# EAGLE design Impedance (EAGLE 9.6.2)
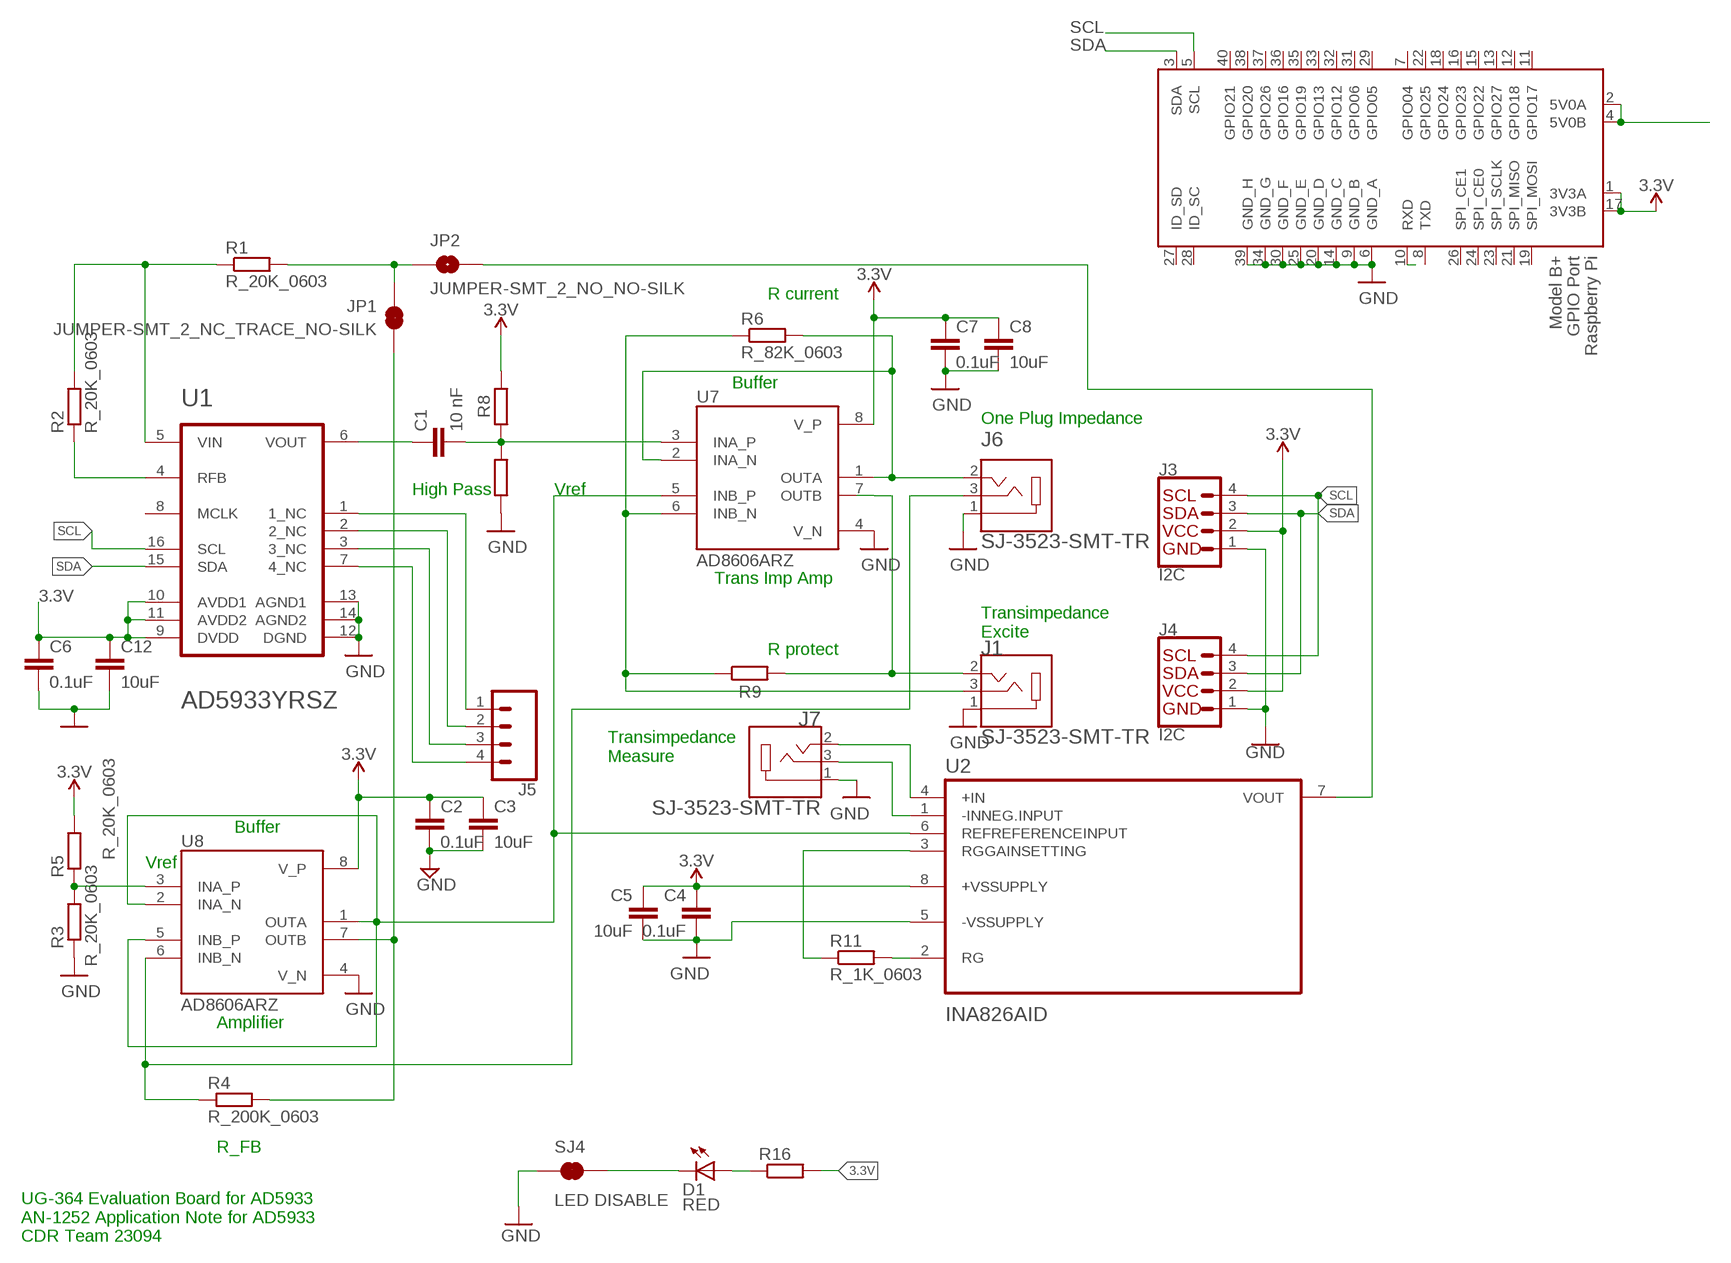
[diagram p0: schematic, sheet 1]

## Parts
C1  10 nF  3.3NF-0603-100V-10%  [0603]
C2  0.1uF  0.1UF-0603-25V-(+80/-20%)  [0603]
C3  10uF  10UF-0603-6.3V-20%  [0603]
C4  0.1uF  0.1UF-0603-25V-(+80/-20%)  [0603]
C5  10uF  10UF-0603-6.3V-20%  [0603]
C6  0.1uF  0.1UF-0603-25V-(+80/-20%)  [0603]
C7  0.1uF  0.1UF-0603-25V-(+80/-20%)  [0603]
C8  10uF  10UF-0603-6.3V-20%  [0603]
C12  10uF  10UF-0603-6.3V-20%  [0603]
D1  RED  LED-RED0603  [LED-0603]
J1  SJ-3523-SMT-TR  [CUI_SJ-3523-SMT-TR]
J3  I2C  QWIIC_CONNECTORJS-1MM  [JST04_1MM_RA]
J4  I2C  QWIIC_CONNECTORJS-1MM  [JST04_1MM_RA]
J5  CONN_04  [1X04]
J6  SJ-3523-SMT-TR  [CUI_SJ-3523-SMT-TR]
J7  SJ-3523-SMT-TR  [CUI_SJ-3523-SMT-TR]
JP1  JUMPER-SMT_2_NC_TRACE_NO-SILK  [SMT-JUMPER_2_NC_TRACE_NO-SILK]
JP2  JUMPER-SMT_2_NO_NO-SILK  [SMT-JUMPER_2_NO_NO-SILK]
R1  R_20K_0603  [R0603]
R2  R_20K_0603  [R0603]
R3  R_20K_0603  [R0603]
R4  R_200K_0603  [R0603]
R5  R_20K_0603  [R0603]
R6  R_82K_0603  [R0603]
R7  100 kO  R_100K_0603  [R0603]
R8  100 kO  R_100K_0603  [R0603]
R9  1 MO  R_82K_0603  [R0603]
R11  R_1K_0603  [R0603]
R16  R__0603  R_1K_0603  [R0603]
SJ4  LED DISABLE  JUMPER-SMT_2_NC_TRACE_NO-SILK  [SMT-JUMPER_2_NC_TRACE_NO-SILK]
U1  ANALOG_DEVICES_AD5933YRSZANALOG_DEVICES_AD5933YRSZ_0_0  [ANALOG_DEVICES_AD5933YRSZ_0]
U2  INA826AID  [SOIC127P599X175-8N]
U7  AD8606ARZ  [SOIC127P600X175-8N]
U8  AD8606ARZ  [SOIC127P600X175-8N]
X1  RASPI_BOARD_B+#_H  [RASPI_BOARD_B+HAT]

## Nets
3.3V: C2.1 C3.1 C4.1 C5.1 C6.1 C7.1 C8.1 C12.1 J3.2 J4.2 R5.2 R8.2 R16.2 U1.9(DVDD) U1.10(AVDD1) U1.11(AVDD2) U2.8(+VSSUPPLY) U7.8(V_P) U8.8(V_P) X1.1(3V3A) X1.17(3V3B)
GND: C2.2 C3.2 C4.2 C5.2 C6.2 C7.2 C8.2 C12.2 J1.1 J3.1 J4.1 J6.1 J7.1 R3.1 R7.1 SJ4.1 U1.12(DGND) U1.13(AGND1) U1.14(AGND2) U2.5(-VSSUPPLY) U7.4(V_N) U8.4(V_N) X1.6(GND_A) X1.9(GND_B) X1.14(GND_C) X1.20(GND_D) X1.25(GND_E) X1.30(GND_F) X1.34(GND_G) X1.39(GND_H)
N$1: D1.A R16.1
N$2: J5.1 U1.1(1_NC)
N$3: C1.1 U1.6(VOUT)
N$4: J5.2 U1.2(2_NC)
N$5: J1.3 R6.1 R9.1 U7.6(INB_N)
N$6: J1.2 R9.2 U7.7(OUTB)
N$7: U2.6(REFREFERENCEINPUT) U7.5(INB_P) U8.1(OUTA) U8.2(INA_N) U8.5(INB_P)
N$8: J6.3 R4.1 U8.6(INB_N)
N$9: R1.1 R2.2 U1.5(VIN)
N$10: D1.C SJ4.2
N$11: R3.2 R5.1 U8.3(INA_P)
N$12: J5.3 U1.3(3_NC)
N$13: C1.2 R7.2 R8.1 U7.3(INA_P)
N$14: R2.1 U1.4(RFB)
N$15: J5.4 U1.7(4_NC)
N$16: J7.2 U2.4(+IN)
N$17: J6.2 R6.2 U7.1(OUTA) U7.2(INA_N)
N$18: J7.3 U2.1(-INNEG.INPUT)
N$19: R11.1 U2.3(RGGAINSETTING)
N$20: R11.2 U2.2(RG)
N$21: JP2.2 U2.7(VOUT)
N$22: JP1.2 JP2.1 R1.2
N$25: X1.2(5V0A) X1.4(5V0B)
N$26: X1.10(RXD)
SCL: J3.4 J4.4 U1.16(SCL) X1.5(SCL)
SDA: J3.3 J4.3 U1.15(SDA) X1.3(SDA)
SIGIN: JP1.1 R4.2 U8.7(OUTB)
Unconnected: U1.8(MCLK) X1.7(GPIO04) X1.8(TXD) X1.11(GPIO17) X1.12(GPIO18) X1.13(GPIO27) X1.15(GPIO22) X1.16(GPIO23) X1.18(GPIO24) X1.19(SPI_MOSI) X1.21(SPI_MISO) X1.22(GPIO25) X1.23(SPI_SCLK) X1.24(SPI_CE0) X1.26(SPI_CE1) X1.27(ID_SD) X1.28(ID_SC) X1.29(GPIO05) X1.31(GPIO06) X1.32(GPIO12) X1.33(GPIO13) X1.35(GPIO19) X1.36(GPIO16) X1.37(GPIO26) X1.38(GPIO20) X1.40(GPIO21)

## Notes on the sheet
- R current
- Buffer
- One Plug Impedance
- High Pass | Vref
- Trans Imp Amp
- Transimpedance
  Excite
- R protect
- Transimpedance
  Measure
- Buffer
- Vref
- Amplifier
- R_FB
- UG-364 Evaluation Board for AD5933
  AN-1252 Application Note for AD5933
  CDR Team 23094

## Library data of the parts
C1 = SparkFun-Capacitors:3.3NF: 3.3nF ceramic capacitors A capacitor is a passive two-terminal electrical component used to store electrical energy temporarily in an electric field.; PROD_ID: CAP-09633; VALUE: 3.3nF
C2 C4 C6 C7 = SparkFun-Capacitors:0.1UF: 0.1µF ceramic capacitors A capacitor is a passive two-terminal electrical component used to store electrical energy temporarily in an electric field.; PROD_ID: CAP-00810
C3 C5 C8 C12 = SparkFun-Capacitors:10UF: 10.0µF ceramic capacitors A capacitor is a passive two-terminal electrical component used to store electrical energy temporarily in an electric field.; PROD_ID: CAP-11015
D1 = SparkFun-LED:LED-RED: Assorted Red LEDs LilyPad 1206- DIO-09912 1206- DIO-00809 0603- DIO-00819; PROD_ID: DIO-00819
J1 J6 J7 = SJ-3523-SMT-TR:SJ-3523-SMT-TR: Audio Jack Connector 3.5 mm Low Profile Surface Mount Stereo Jack, 3 Pin Right-Angle Check availability <https://pricing.snapeda.com/parts/SJ-3523-SMT-TR/CUI%20Devices/view-part?ref=eda>; AVAILABILITY: In Stock; CUI_PURCHASE_URL: https://www.cuidevices.com/product/interconnect/connectors/audio-connectors/jacks/sj-352x-smt-series?utm_source=snapeda.com&utm_medium=referral&utm_campaign=snapedaBOM; DESCRIPTION: 3.5 mm, Stereo, Right Angle, Surface Mount (SMT), 3 Conductors, 0~1 Internal Switches, Audio Jack Connector; MF: CUI Devices; MP: SJ-3523-SMT-TR; PACKAGE: None; PRICE: None; PURCHASE-URL: https://pricing.snapeda.com/search/part/SJ-3523-SMT-TR/?ref=eda
J3 J4 = SparkFun-Connectors:QWIIC_CONNECTOR: SparkFun I2C Standard Qwiic Connector An SMD 1mm pitch JST connector makes it easy and quick (get it? Qwiic?) to connect I2C devices to each other. The Qwiic system <http://www.sparkfun.com/qwiic> enables fast and solderless connection between popular platforms and various sensors and actuators. We carry 200mm <https://www.sparkfun.com/products/14204>, 100mm <https://www.sparkfun.com/products/14205>, 50mm <https://www.sparkfun.com/products/14206>, and breadboard friendly <https://www.sparkfun.com/products/14207> Qwiic cables. We also offer 10 pcs strips <https://www.sparkfun.com/products/14323> the SMD connectors.; PROD_ID: CONN-13694
J5 = SparkFun-Connectors:CONN_04: Multi connection point. Often used as Generic Header-pin footprint for 0.1 inch spaced/style header connections On any of the 0.1 inch spaced packages, you can populate with these: Break Away Headers - Straight <https://www.sparkfun.com/products/116> (PRT-00116) Break Away Male Headers - Right Angle <https://www.sparkfun.com/products/553> (PRT-00553) Female Headers <https://www.sparkfun.com/products/115> (PRT-00115) Break Away Headers - Machine Pin <https://www.sparkfun.com/products/117> (PRT-00117) Break Away Female Headers - Swiss Machine Pin <https://www.sparkfun.com/products/743> (PRT-00743) For SCREWTERMINALS and SPRING TERMINALS visit here: Screw Terimnals on SparkFun.com <https://www.sparkfun.com/search/results?term=Screw+Terminals> (5mm/3.5mm/2.54mm spacing) This device is also useful as a general connection point to wire up your design to another part of your project. Our various solder wires solder well into these plated through hole pads. Hook-Up Wire - Assortment (Stranded, 22 AWG) <https://www.sparkfun.com/products/11375> (PRT-11375) Hook-Up Wire - Assortment (Solid Core, 22 AWG) <https://www.sparkfun.com/products/11367> (PRT-11367) View the entire wire category on our website here <https://www.sparkfun.com/categories/141> Special notes: Molex polarized connector foot print use with SKU : PRT-08231 with associated crimp pins and housings. 1MM SMD Version SKU: PRT-10208; PROD_ID: CONN-09696
JP1 SJ4 = SparkFun-Jumpers:JUMPER-SMT_2_NC_TRACE: Normally closed trace jumper This jumper has a trace between two pads so it's normally closed (NC). Use a razor knife to open the connection. For best results follow the IPC guidelines for cutting traces: Cutout at least 0.063 mm (0.005 in). Remove all loose material to clean up the cut area. Seal the cut with an approved epoxy. Reapply solder to reclose the connection.
JP2 = SparkFun-Jumpers:JUMPER-SMT_2_NO: Normally open jumper This jumper has two pads in close proximity to each other. Apply solder to close the connection. Round pads are easier to solder for beginners, but are a lot larger. SparkFun Product that uses the round pads: SparkFun EL Sequencer <https://www.sparkfun.com/products/12781>
R1-R3 R5 = JLC PCB Basic Parts_loc:R_: Resistor General purpose SMD Resistor; LCSC_DATASHEET: https://datasheet.lcsc.com/lcsc/2110251730_UNI-ROYAL-Uniroyal-Elec-0603WAF2002T5E_C4184.pdf; LCSC_PART: C4184; LCSC_ROTATION_CCW: 0; LCSC_STOCK: 2014241; PROPERTIES: ±1% 1/10W Thick Film Resistors 75V ±100ppm -55°C~+155°C 20kOhm 0603 ROHS
R4 = JLC PCB Basic Parts_loc:R_: Resistor General purpose SMD Resistor; LCSC_DATASHEET: https://datasheet.lcsc.com/lcsc/2110260030_UNI-ROYAL-Uniroyal-Elec-0603WAF2003T5E_C25811.pdf; LCSC_PART: C25811; LCSC_ROTATION_CCW: 0; LCSC_STOCK: 665451; PROPERTIES: ±1% 1/10W Thick Film Resistors 75V ±100ppm -55°C~+155°C 200kOhm 0603 ROHS
R6 R9 = JLC PCB Basic Parts_loc:R_: Resistor General purpose SMD Resistor; LCSC_DATASHEET: https://datasheet.lcsc.com/lcsc/2110252230_UNI-ROYAL-Uniroyal-Elec-0603WAF8202T5E_C23254.pdf; LCSC_PART: C23254; LCSC_ROTATION_CCW: 0; LCSC_STOCK: 103891; PROPERTIES: ±1% 1/10W Thick Film Resistors 75V ±100ppm -55°C~+155°C 82kOhm 0603 ROHS
R7 R8 = JLC PCB Basic Parts_loc:R_: Resistor General purpose SMD Resistor; LCSC_DATASHEET: https://datasheet.lcsc.com/lcsc/2110260030_UNI-ROYAL-Uniroyal-Elec-0603WAF1003T5E_C25803.pdf; LCSC_PART: C25803; LCSC_ROTATION_CCW: 0; LCSC_STOCK: 5826279; PROPERTIES: ±1% 1/10W Thick Film Resistors 75V ±100ppm -55°C~+155°C 100kOhm 0603 ROHS
R11 R16 = JLC PCB Basic Parts_loc:R_: Resistor General purpose SMD Resistor; LCSC_DATASHEET: https://datasheet.lcsc.com/lcsc/2110252030_UNI-ROYAL-Uniroyal-Elec-0603WAF1001T5E_C21190.pdf; LCSC_PART: C21190; LCSC_ROTATION_CCW: 0; LCSC_STOCK: 5175299; PROPERTIES: ±1% 1/10W Thick Film Resistors 75V ±100ppm -55°C~+155°C 1kOhm 0603 ROHS
U1 = Analog Devices - AD5933YRSZ:ANALOG_DEVICES_AD5933YRSZ: ADI-AD5933-RS-16; CIIVA_IDS: 19299999; CODE__JEDEC: MO-150-AC; COMPONENT_LINK_1_DESCRIPTION: Manufacturer URL; COMPONENT_LINK_1_URL: www.analog.com; COMPONENT_LINK_3_DESCRIPTION: Package Specification; COMPONENT_LINK_3_URL: http://www.analog.com/static/imported-files/packages/31572257652246RS_16.pdf; DATASHEET: http://www.analog.com/static/imported-files/data_sheets/AD5933.pdf; DATASHEET_VERSION: Rev. D; FOOTPRINT_VARIANT_NAME_0: Level C; FOOTPRINT_VARIANT_NAME_1: Level B; FOOTPRINT_VARIANT_NAME_2: Level A; IMPORTED: yes; IMPORTED_FROM: vault; IMPORT_TS: 1521848033; IO_INTERFACE: Serial; I_SUPPLY_TOTAL_MAX: 15mA; MASTER_FCLK: 16.776MHz; MF: Analog Devices; MPN: AD5933YRSZ; PACKAGE: RS-16; PACKAGE_DESCRIPTION: 16-Lead Shrink Small Outline Package [SSOP]; PACKAGE_VERSION: 3/17/2005; PIN_0_0_15_INSIDE_EDGE: clock; PIN_0_0_7_INSIDE_EDGE: clock; PREFIX: U; RELEASE_DATE: 1333437714; RESOLUTION_BITS: 12bit; TUNING_WORD_WIDTH_BITS: 27bit; VAULT_GUID: 12E548FF-7E75-4596-9B3A-06B167E4919E; VAULT_REVISION: 0B288880-7FBC-46A2-8187-17CED40A7223
U2 = INA826AID:INA826AID: Check availability <https://pricing.snapeda.com/parts/INA826AID/Texas%20Instruments/view-part?ref=eda>; AVAILABILITY: In Stock; CHECK_PRICES: https://www.snapeda.com/parts/INA826AID/Texas+Instruments/view-part/?ref=eda; DESCRIPTION: Precision, 200-μA Supply Current, 36-V Supply Instrumentation Amplifier; MF: Texas Instruments; MP: INA826AID; PACKAGE: SOIC-8 Texas Instruments; PRICE: None; PURCHASE-URL: https://www.snapeda.com/api/url_track_click_mouser/?unipart_id=217743&manufacturer=Texas Instruments&part_name=INA826AID&search_term=None; SNAPEDA_LINK: https://www.snapeda.com/parts/INA826AID/Texas+Instruments/view-part/?ref=snap
U7 U8 = AD8606ARZ:AD8606ARZ: Operational amplifier; 10MHz; 2.7÷5VDC; Channels: 2; SO8 Check availability <https://pricing.snapeda.com/parts/AD8606ARZ/Analog%20Devices/view-part?ref=eda>; AVAILABILITY: In Stock; CHECK_PRICES: https://www.snapeda.com/parts/AD8606ARZ/Analog+Devices/view-part/?ref=eda; DESCRIPTION: Precision, Low Noise, RRIO, CMOS Op Amp (Dual); MF: Analog Devices; MP: AD8606ARZ; PACKAGE: SOIC-8 Analog Devices; PRICE: None; PURCHASE-URL: https://www.snapeda.com/api/url_track_click_mouser/?unipart_id=43414&manufacturer=Analog Devices&part_name=AD8606ARZ&search_term=None; SNAPEDA_LINK: https://www.snapeda.com/parts/AD8606ARZ/Analog+Devices/view-part/?ref=snap
X1 = raspberrypi_bastelstube_v13:RASPI_BOARD_B+#: Raspberry Pi GPIO connector with markings for the outer dimensions of the Raspberry Pi board model B+ with different sets of drill holes or mounting pads All pins connected

## Board
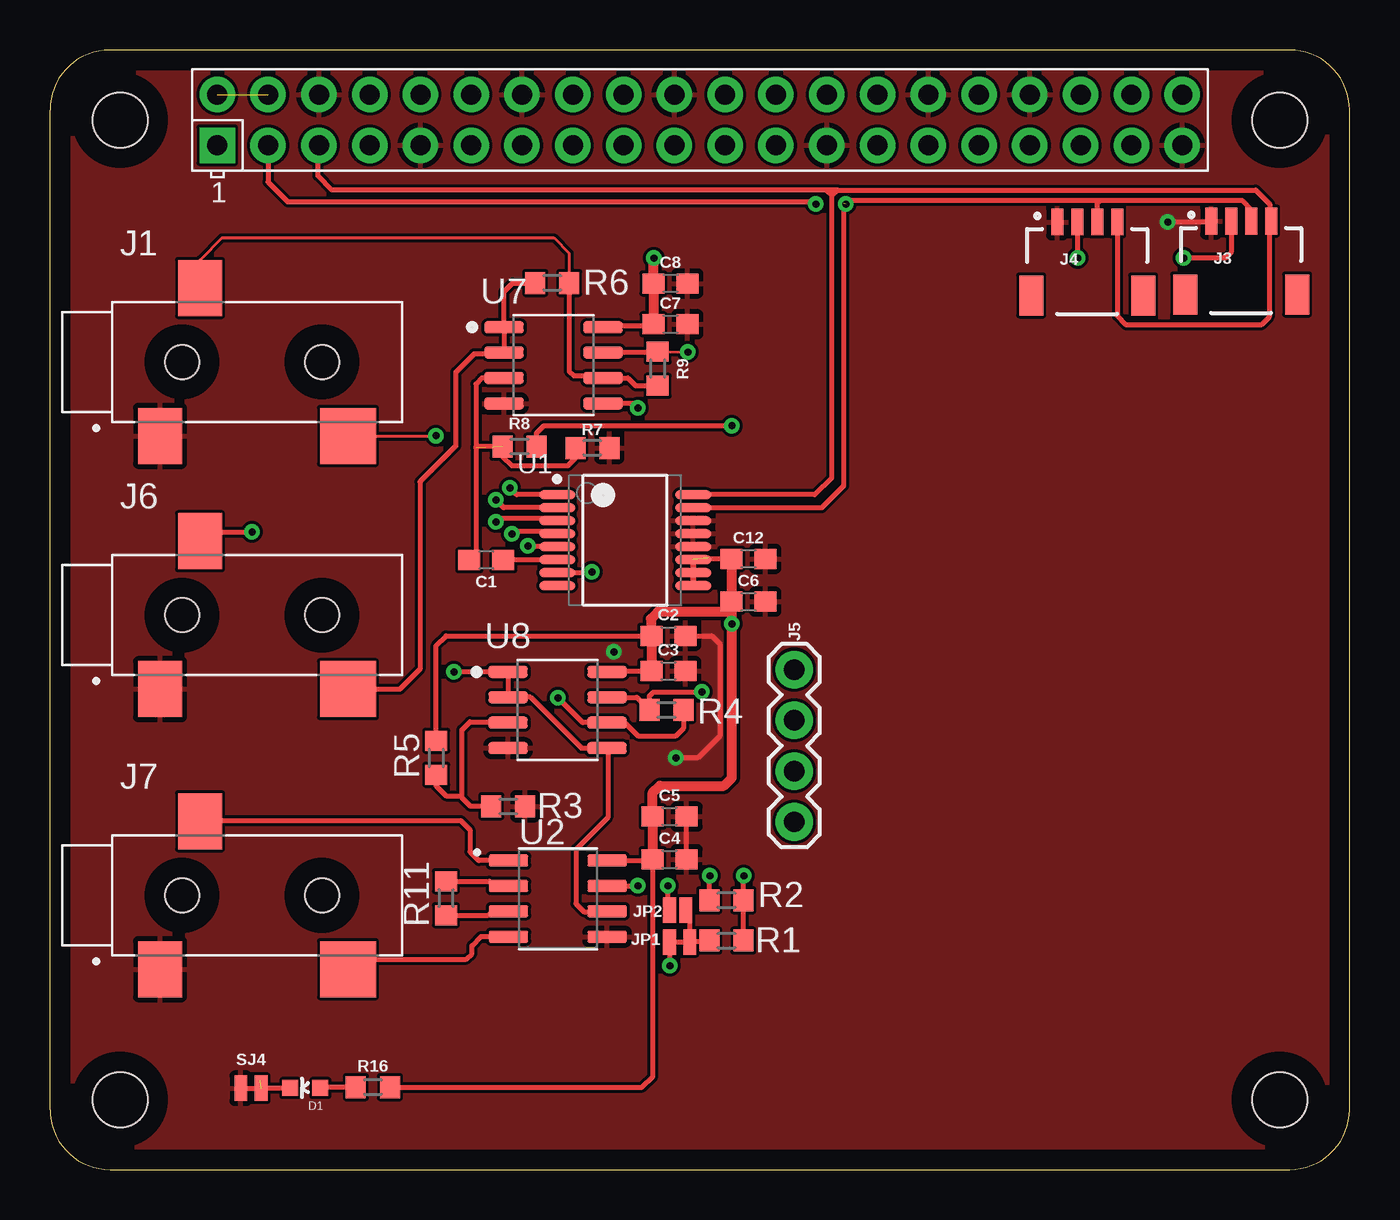
[diagram p1: board, top side]
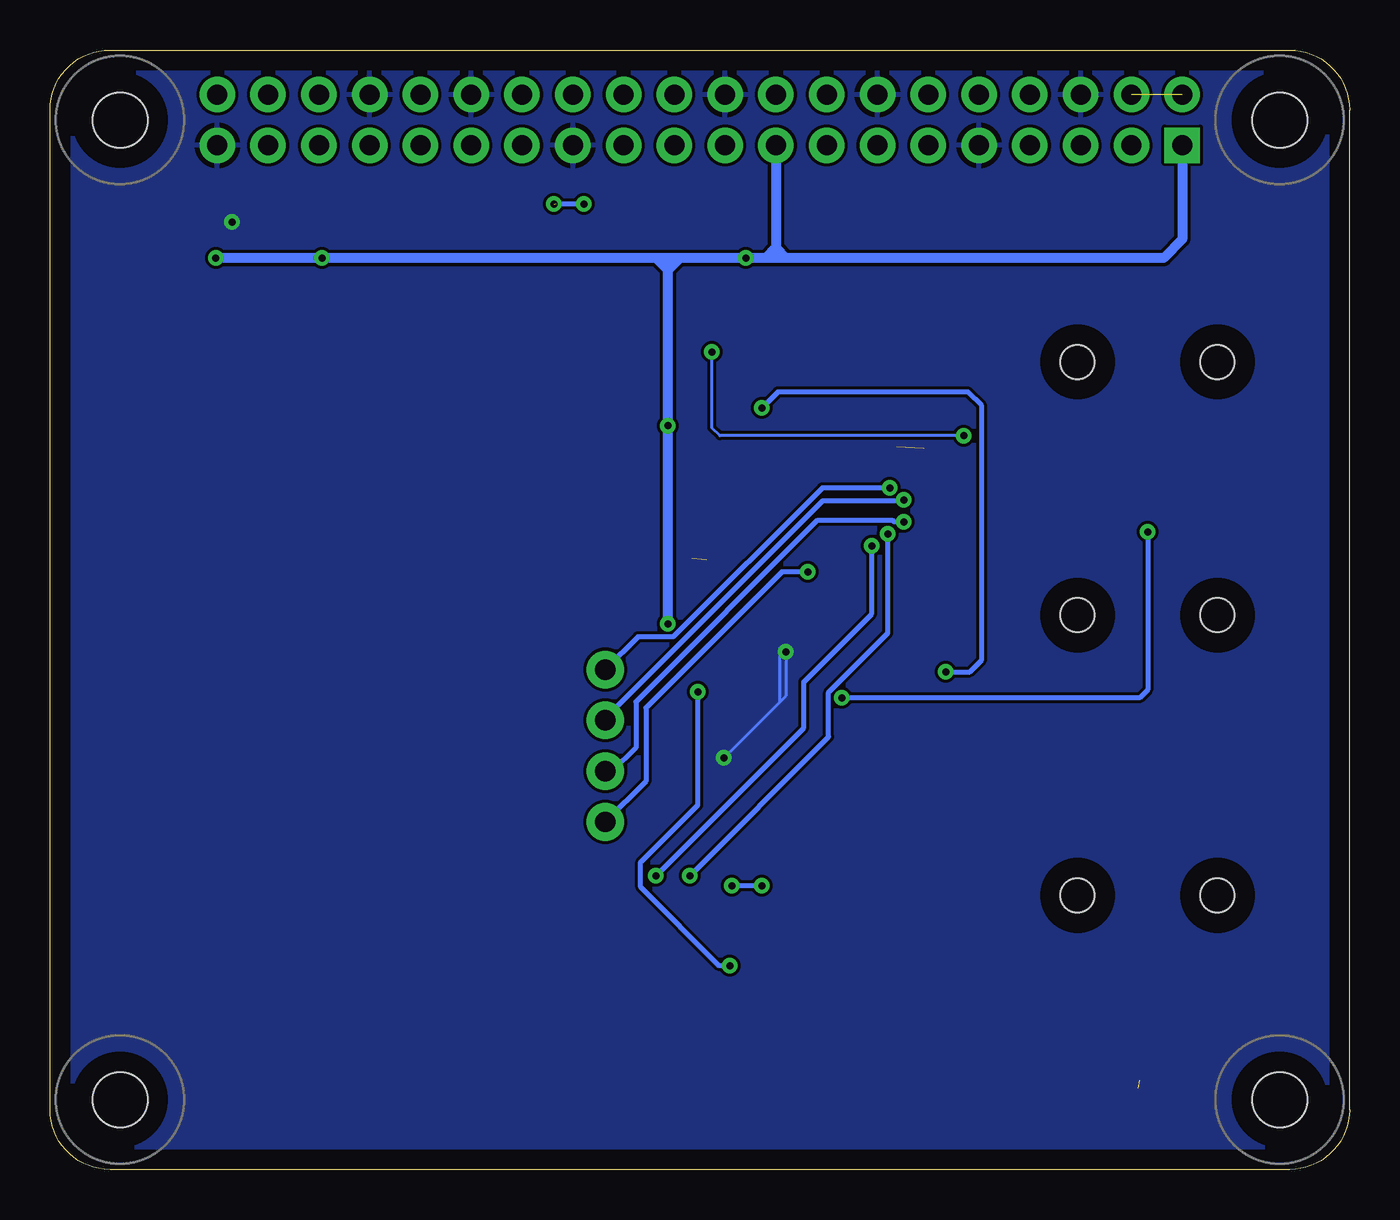
[diagram p2: board, bottom side, seen from below]

Size 65 x 56 mm. Coordinates in mm from the lower left corner, seen from the top.
Copper layers (1*16): Top 0.035mm / dielectric 1.5mm / Bottom 0.035mm
Design rules "default": minimum track width 6mil, minimum drill 0.35mm, track to track 6mil, track to pad 6mil, pad to pad 6mil, via to via 6mil, smd to smd 6mil, copper to edge 40mil, drill to drill 6mil, minimum pad ring 10mil, minimum via ring 8mil, stop-mask expansion 4mil, vias tented up to drill 0mil, thermal gap 10mil

### Footprints (pad centres in the part's own frame; a part is rotated, then mirrored left to right if it is on the bottom)
0603 = smd 1.1 x 1: 1 -0.85,0; 2 0.85,0
LED-0603 = smd 0.8 x 0.8: A 0,-0.75; C 0,0.75
CUI_SJ-3523-SMT-TR = smd 2.2 x 2.8: 1 -1.1,-3.7; 3 0.9,3.7 | smd 2.8 x 2.8: 2 8.3,-3.7 | hole 1.7: 0,0; 7,0
JST04_1MM_RA = smd 0.6 x 1.35: 1 -1.5,0; 2 -0.5,0; 3 0.5,0; 4 1.5,0 | smd 1.2 x 2: NC1 2.8,-3.675; NC2 -2.8,-3.675
1X04 = drill 1.016 pad 1.88: 1 0,0; 2 2.54,0; 3 5.08,0; 4 7.62,0
SMT-JUMPER_2_NC_TRACE_NO-SILK = smd 0.635 x 1.27: 1 -0.508,0; 2 0.508,0
SMT-JUMPER_2_NO_NO-SILK = smd 0.635 x 1.27: 1 -0.406,0; 2 0.406,0
R0603 = smd 1 x 1.1: 1 -0.85,0; 2 0.85,0
ANALOG_DEVICES_AD5933YRSZ_0 = smd 1.8 x 0.45: 1 -3.4,2.275; 2 -3.4,1.625; 3 -3.4,0.975; 4 -3.4,0.325; 5 -3.4,-0.325; 6 -3.4,-0.975; 7 -3.4,-1.625; 8 -3.4,-2.275; 9 3.4,-2.275; 10 3.4,-1.625; 11 3.4,-0.975; 12 3.4,-0.325; 13 3.4,0.325; 14 3.4,0.975; 15 3.4,1.625; 16 3.4,2.275
SOIC127P599X175-8N = smd 1.97 x 0.6: 1 -2.47,1.905; 2 -2.47,0.635; 3 -2.47,-0.635; 4 -2.47,-1.905; 5 2.47,-1.905; 6 2.47,-0.635; 7 2.47,0.635; 8 2.47,1.905
SOIC127P600X175-8N = smd 1.97 x 0.6: 1 -2.475,1.905; 2 -2.475,0.635; 3 -2.475,-0.635; 4 -2.475,-1.905; 5 2.475,-1.905; 6 2.475,-0.635; 7 2.475,0.635; 8 2.475,1.905
RASPI_BOARD_B+HAT = drill 1 pad 1.778 square: 1 8.37,51.23 | drill 1 pad 1.778: 2 8.37,53.77; 3 10.91,51.23; 4 10.91,53.77; 5 13.45,51.23; 6 13.45,53.77; 7 15.99,51.23; 8 15.99,53.77; 9 18.53,51.23; 10 18.53,53.77; 11 21.07,51.23; 12 21.07,53.77; 13 23.61,51.23; 14 23.61,53.77; 15 26.15,51.23; 16 26.15,53.77; 17 28.69,51.23; 18 28.69,53.77; 19 31.23,51.23; 20 31.23,53.77; 21 33.77,51.23; 22 33.77,53.77; 23 36.31,51.23; 24 36.31,53.77; 25 38.85,51.23; 26 38.85,53.77; 27 41.39,51.23; 28 41.39,53.77; 29 43.93,51.23; 30 43.93,53.77; 31 46.47,51.23; 32 46.47,53.77; 33 49.01,51.23; 34 49.01,53.77; 35 51.55,51.23; 36 51.55,53.77; 37 54.09,51.23; 38 54.09,53.77; 39 56.63,51.23; 40 56.63,53.77 | hole 2.75: 3.5,3.5; 3.5,52.5; 61.5,3.5; 61.5,52.5

### Placement (x,y rotation side)
C1  21.82,30.49 180 top
C2  30.94,26.69 0 top
C3  30.94,24.94 0 top
C4  30.99,15.52 0 top
C5  30.99,17.66 0 top
C6  34.94,28.4 0 top
C7  31.04,42.28 0 top
C8  31.04,44.32 0 top
C12  34.94,30.55 0 top
D1  12.77,4.08 90 top
J1  6.6,40.39 0 top
J3  59.58,47.45 0 top
J4  51.88,47.4 0 top
J5  37.23,25.01 270 top
J6  6.6,27.73 0 top
J7  6.6,13.72 0 top
JP1  31.49,11.38 0 top
JP2  31.39,12.98 180 top
R1  33.84,11.45 180 top
R2  33.84,13.47 0 top
R3  22.92,18.17 180 top
R4  30.84,22.99 180 top
R5  19.32,20.59 90 top
R6  25.12,44.34 180 top
R7  27.13,36.1 180 top
R8  23.48,36.16 0 top
R9  30.4,40.06 90 top
R11  19.81,13.57 90 top
R16  16.15,4.12 0 top
SJ4  10.05,4.07 0 top
U1  28.77,31.48 0 top
U2  25.4,13.55 0 top
U7  25.18,40.23 0 top
U8  25.39,22.99 0 top
X1  0,0 0 top

### Tracks (layer width: path | path; a pad name or v marks a point on that pad's centre or on a via)
3.3V  (via drill 0.35)  (1 unrouted)
  Top 0.254: U2.8 30.08,15.45 C4.1 30.15,15.51 30.15,4.65 29.62,4.12 R16.2 | C7.1 30.09,42.18 27.7,42.18 U7.8 | C12.1 32.95,30.55 32.9,30.6 | J3.2 59.08,45.88 58.8,45.6 v56.7,45.6 | C6.1 34.09,27.99 34,27.9 | 30.09,25 C3.1 27.91,24.94 U8.8 | 29.89,26.49 30.05,26.65 | 30.05,26.65 C2.1 | R8.2 24.33,36.83 24.7,37.2 v34.1,37.2 | v30.2,45.6 30.19,45.59 | R5.2 19.32,26.22 19.8,26.7 30,26.7 30.05,26.65 | J4.2 51.38,45.62 v51.4,45.6
  Top 0.305: U1.11 U1.10 U1.9
  Top 0.508: C4.1 C5.1 30.14,18.84 30.5,19.2 33.7,19.2 34.1,19.6 v34.1,27.3 C6.1 | C7.1 C8.1 30.19,45.59 | C12.1 C6.1 | 34,27.9 30.4,27.9 30.05,27.55 30.05,26.65 C2.1 30.09,25 30.14,24.94
  Bottom 0.508: 33.5,45.6 v30.2,45.6 29.2,45.6 | 33.5,45.6 34.2,45.6 | 34.2,45.6 34.7,45.6 | v34.1,27.3 v34.1,37.2 34.1,45 | 34.1,45 34.1,45.5 34.2,45.6 | 34.7,45.6 34.1,45 | 34.1,45 33.5,45.6 | 34.7,45.6 v51.4,45.6 v56.7,45.6 | X1.17 28.7,46.1 | 28.7,46.1 29.2,45.6 | X1.1 8.37,46.53 9.3,45.6 29.2,45.6 | 28.7,46.1 28.2,45.6
GND  (via drill 0.35)
  Top 0.254: C4.2 C5.2 | C2.2 31.9,26.69 33.1,26.7 33.5,26.3 33.5,21.7 32.4,20.6 v31.3,20.6 | J3.1 58.03,47.4 v55.9,47.4
  Bottom 0.152: 28.5,23.4 28.5,26.1 | v28.2,25.9 28.2,23.7 v31.3,20.6
  pour Bottom: 0,0 65,0 65.07,56 0,56
  pour Top: 0,0 65,0 65,56 0,56
N$1
  Top 0.254: R16.1 13.56,4.12 D1.A
N$2  (via drill 0.35)
  Top 0.254: U1.1 23.34,33.76 v23,34.1
  Bottom 0.254: J5.1 35.59,26.64 33.83,26.64 26.37,34.1 v23,34.1
N$3
  Top 0.254: U1.6 25.35,30.49 C1.1
N$4  (via drill 0.35)
  Top 0.254: U1.2 22.7,33.1 v22.3,33.5
  Bottom 0.254: v22.3,33.5 22.34,33.46 26.34,33.46 37.23,22.57 J5.2
N$5
  Top 0.152: J1.3 7.5,45.49 8.61,46.6 25.2,46.6 25.97,45.83 R6.1
  Top 0.254: R6.1 25.97,39.93 26.2,39.7 27.55,39.7 U7.6 28.91,39.59 29.29,39.21 R9.1
N$6  (via drill 0.35)
  Top 0.152: R9.2 v31.89,40.89 v31.9,40.9 | J1.2 v19.29,36.69 v19.3,36.7
  Top 0.254: R9.2 30.36,40.86 U7.7
  Bottom 0.152: v19.3,36.7 31.5,36.7 31.9,37.1 v31.9,40.9
N$7  (via drill 0.35)
  Top 0.254: U2.6 28,12.91 27.99,12.9 26.7,12.9 26.31,13.29 26.31,16.02 27.9,17.62 27.9,21.05 U8.5 26.57,21.08 24.03,23.63 22.92,23.63 U8.2 U8.1 v20.21,24.89 v20.2,24.9 | v29.4,38.1 29.18,38.32 U7.5
  Bottom 0.254: v20.2,24.9 19,24.9 18.4,25.5 18.4,38.2 19.1,38.9 28.6,38.9 v29.4,38.1
N$8  (via drill 0.35)
  Top 0.254: U8.6 28.75,22.35 29.4,21.7 31.3,21.7 31.7,22.1 31.7,22.98 R4.1 | J6.3 7.97,31.9 v10.1,31.9 | U8.6 26.95,22.35 | U8.6 26.65,22.35 v25.4,23.6
  Bottom 0.254: v10.1,31.9 10.1,24 10.5,23.6 v25.4,23.6
N$9  (via drill 0.35)
  Top 0.254: R1.1 R2.2 34.69,14.69 v34.7,14.7 | 24.7,31.2 24.75,31.16 U1.5 23.95,31.16 v23.9,31.2
  Bottom 0.254: v34.7,14.7 27.3,22.1 27.3,24.4 23.9,27.8 v23.9,31.2
N$10  (1 unrouted)
  Top 0.254: 10.73,4.47 10.5,4.47 | SJ4.2 10.58,4.08 D1.C
N$11
  Top 0.254: R3.2 21.03,18.17 20.6,18.6 20.6,18.7 | U8.3 22.87,22.4 21,22.4 20.6,22 20.6,18.7 | R5.1 19.3,19.76 19.3,19.2 19.8,18.7 20.6,18.7
N$12  (via drill 0.35)
  Top 0.254: U1.3 25.27,32.55 22.45,32.55 v22.3,32.4
  Bottom 0.254: v22.3,32.4 22.77,32.4 22.83,32.46 26.64,32.46 35.7,23.4 35.7,21.1 36.87,19.93 J5.3
N$13  (1 unrouted)
  Top 0.254: U7.3 21.59,39.59 21.3,39.3 21.3,36.1 | C1.2 21.3,30.82 21.3,36.16 R8.1 22.63,35.67 23.1,35.2 25.9,35.2 26.28,35.58 R7.2
N$14  (via drill 0.35)
  Top 0.254: U1.4 25.27,31.91 23.2,31.91 v23.1,31.8 | R2.1 32.99,14.69 v33,14.7
  Bottom 0.254: v33,14.7 26.06,21.64 26.06,23.87 23.1,26.83 v23.1,31.8
N$15  (via drill 0.35)
  Top 0.254: v27.1,29.9 27.05,29.86 U1.7
  Bottom 0.254: v27.1,29.9 28.4,29.9 35.2,23.1 35.2,19.42 J5.4
N$16
  Top 0.152: 22.87,11.7 U2.4
  Top 0.254: U2.4 21.54,11.64 21.1,11.2 21.1,10.8 20.82,10.52 15.4,10.52 J7.2
N$17
  Top 0.254: J6.2 17.5,24.03 18.5,25.03 18.5,34.4 20.3,36.2 20.3,39.9 21.2,40.8 22.64,40.8 U7.2 U7.1 22.7,43.91 23.14,44.34 R6.2
N$18
  Top 0.254: U2.1 21.45,15.45 21,15.9 21,17 20.55,17.45 7.54,17.45 J7.3
N$19
  Top 0.254: R11.1 21.92,12.72 22.2,13 22.84,13 U2.3
N$20
  Top 0.254: R11.2 21.98,14.42 22.22,14.18 U2.2
N$21  (via drill 0.35)
  Top 0.254: v29.4,14.2 27.89,14.2 U2.7 | JP2.2 30.9,13.07 v30.9,14.2
  Bottom 0.254: v29.4,14.2 v30.9,14.2
N$22
  Top 0.254: JP1.2 32.02,11.4 | JP2.1 32,12.78 JP1.2 | R1.2 32.91,11.38 JP1.2
N$25  (1 unrouted)
SCL
  Top 0.254: J4.4 53.38,42.7 53.84,42.25 60.58,42.25 60.98,42.65 60.98,47.35 J3.4 61,47.53 61,48.3 60.3,49 39.4,49 | 39.4,49 39.1,48.7 | 39.1,48.7 39.1,34.6 38.26,33.76 U1.16 | 39.4,49 38.8,49 | 38.8,49 14.1,49 13.4,49.7 13.4,51.18 X1.5 | 39.1,48.7 38.8,49
SDA  (via drill 0.35)  (1 unrouted)
  Top 0.254: J3.3 60.08,48.02 59.65,48.45 52.5,48.45 | U1.15 38.6,33.1 39.7,34.2 39.7,48.3 | X1.3 10.91,49.39 11.9,48.4 38.2,48.4 v38.3,48.3 | v39.8,48.3 39.95,48.45 52.5,48.45 | J4.3 52.38,48.33 52.5,48.45
  Bottom 0.254: v38.3,48.3 v39.8,48.3
SIGIN  (via drill 0.35)
  Top 0.254: JP1.1 30.98,10.22 v31,10.2 | 27.08,23.62 U8.7 29.36,23.62 R4.2 29.99,23.69 30.16,23.86 32.56,23.86 v32.6,23.9
  Bottom 0.254: v32.6,23.9 32.6,18.23 35.46,15.37 35.46,14.13 31.53,10.2 v31,10.2